# EAGLE board sketchv21111.0 (EAGLE 7.6.0)
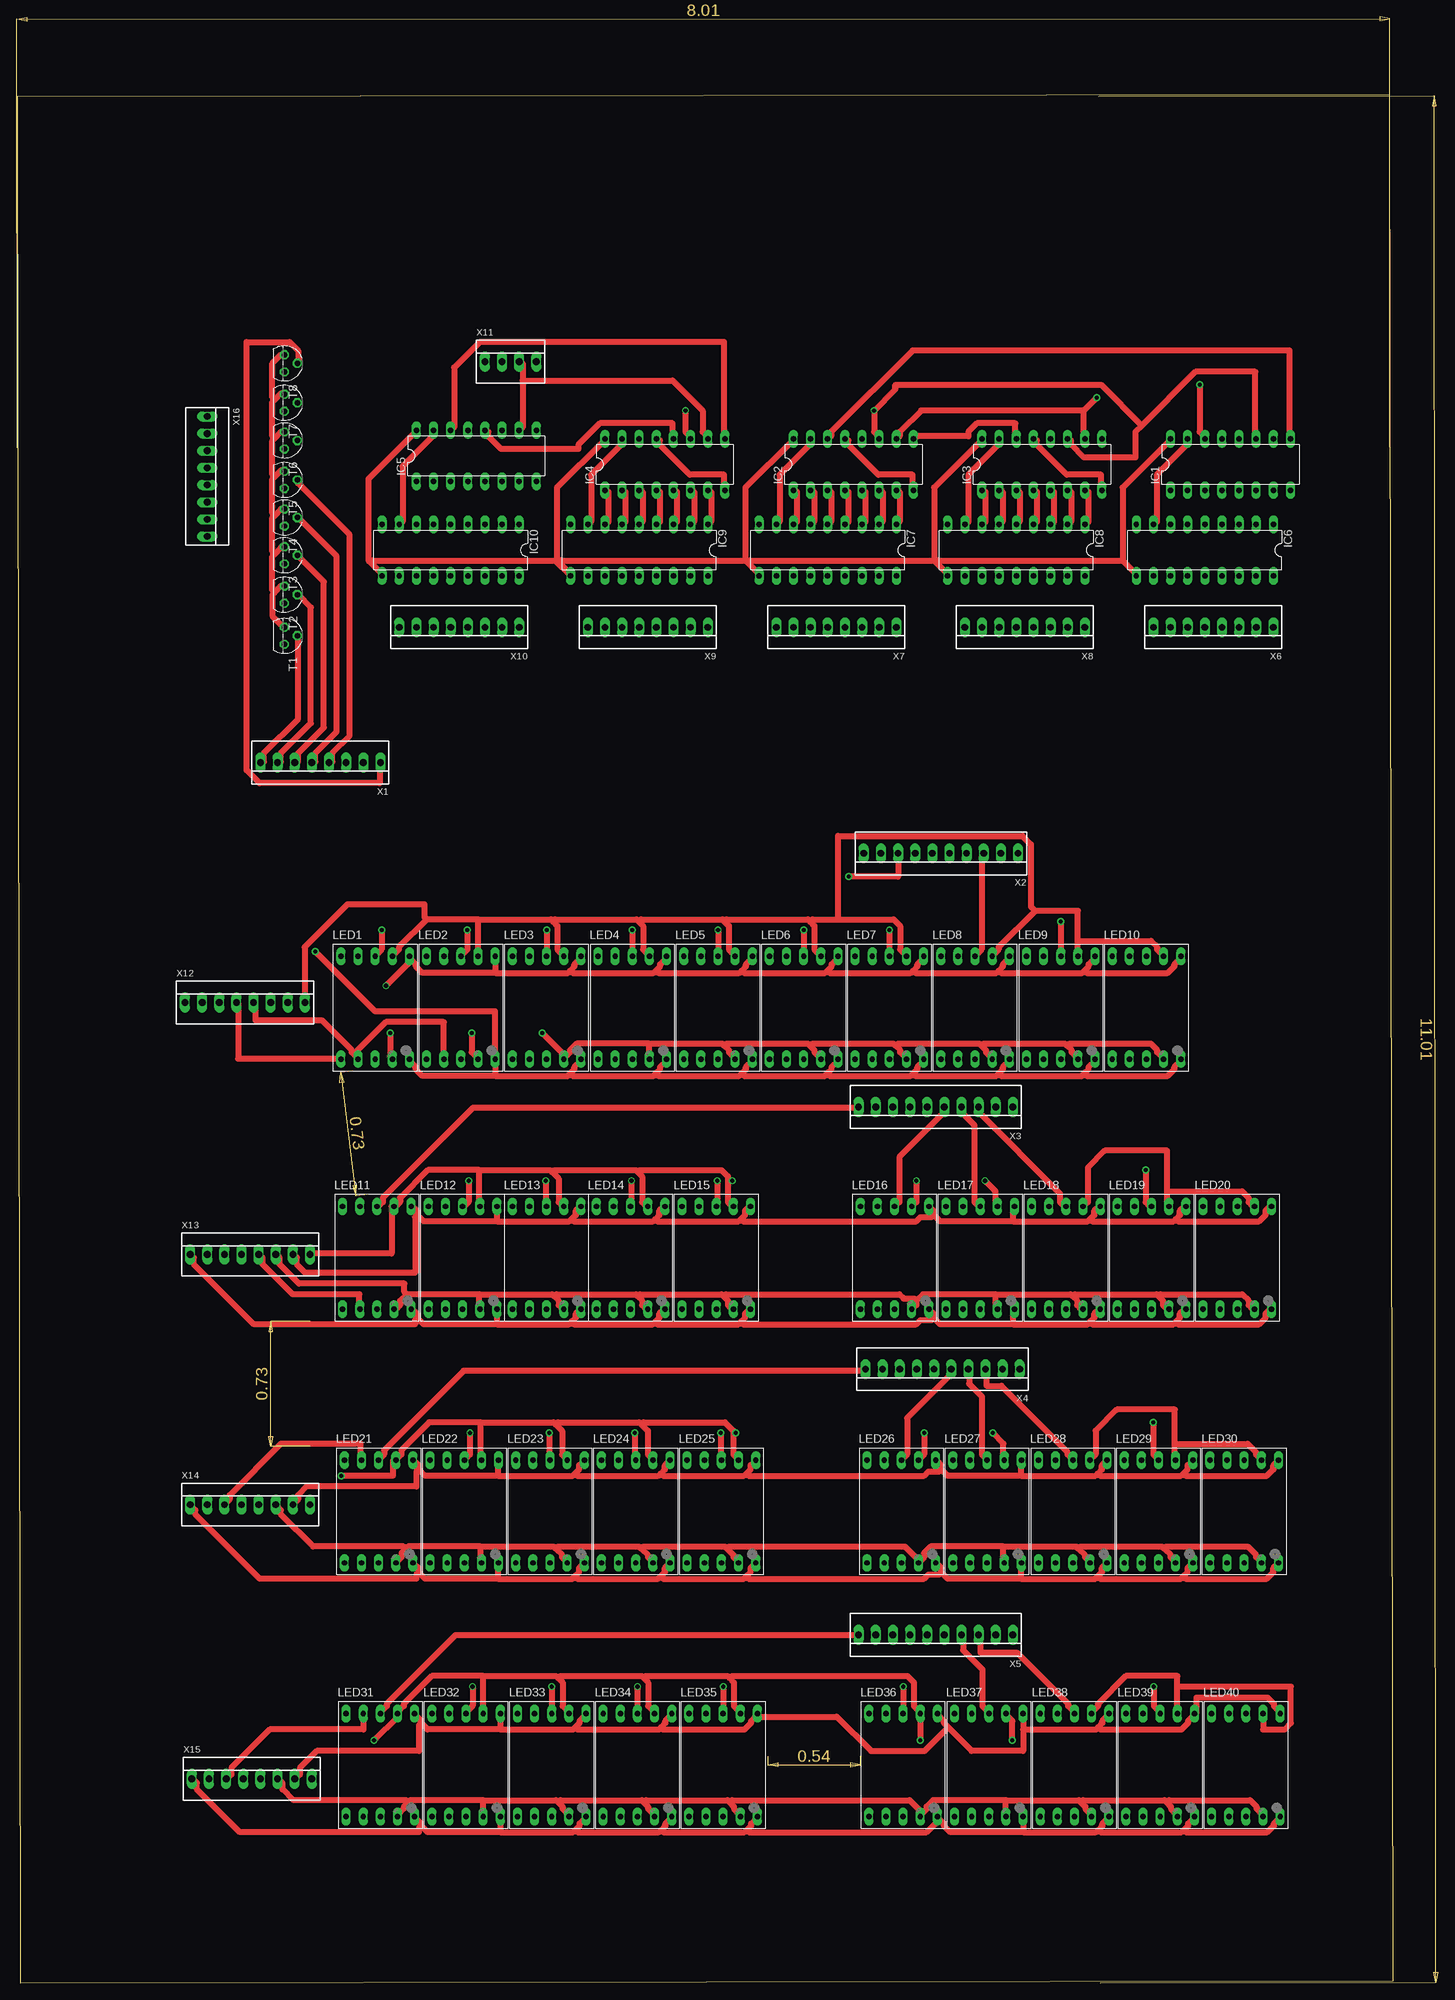
[diagram p1: board, top side]
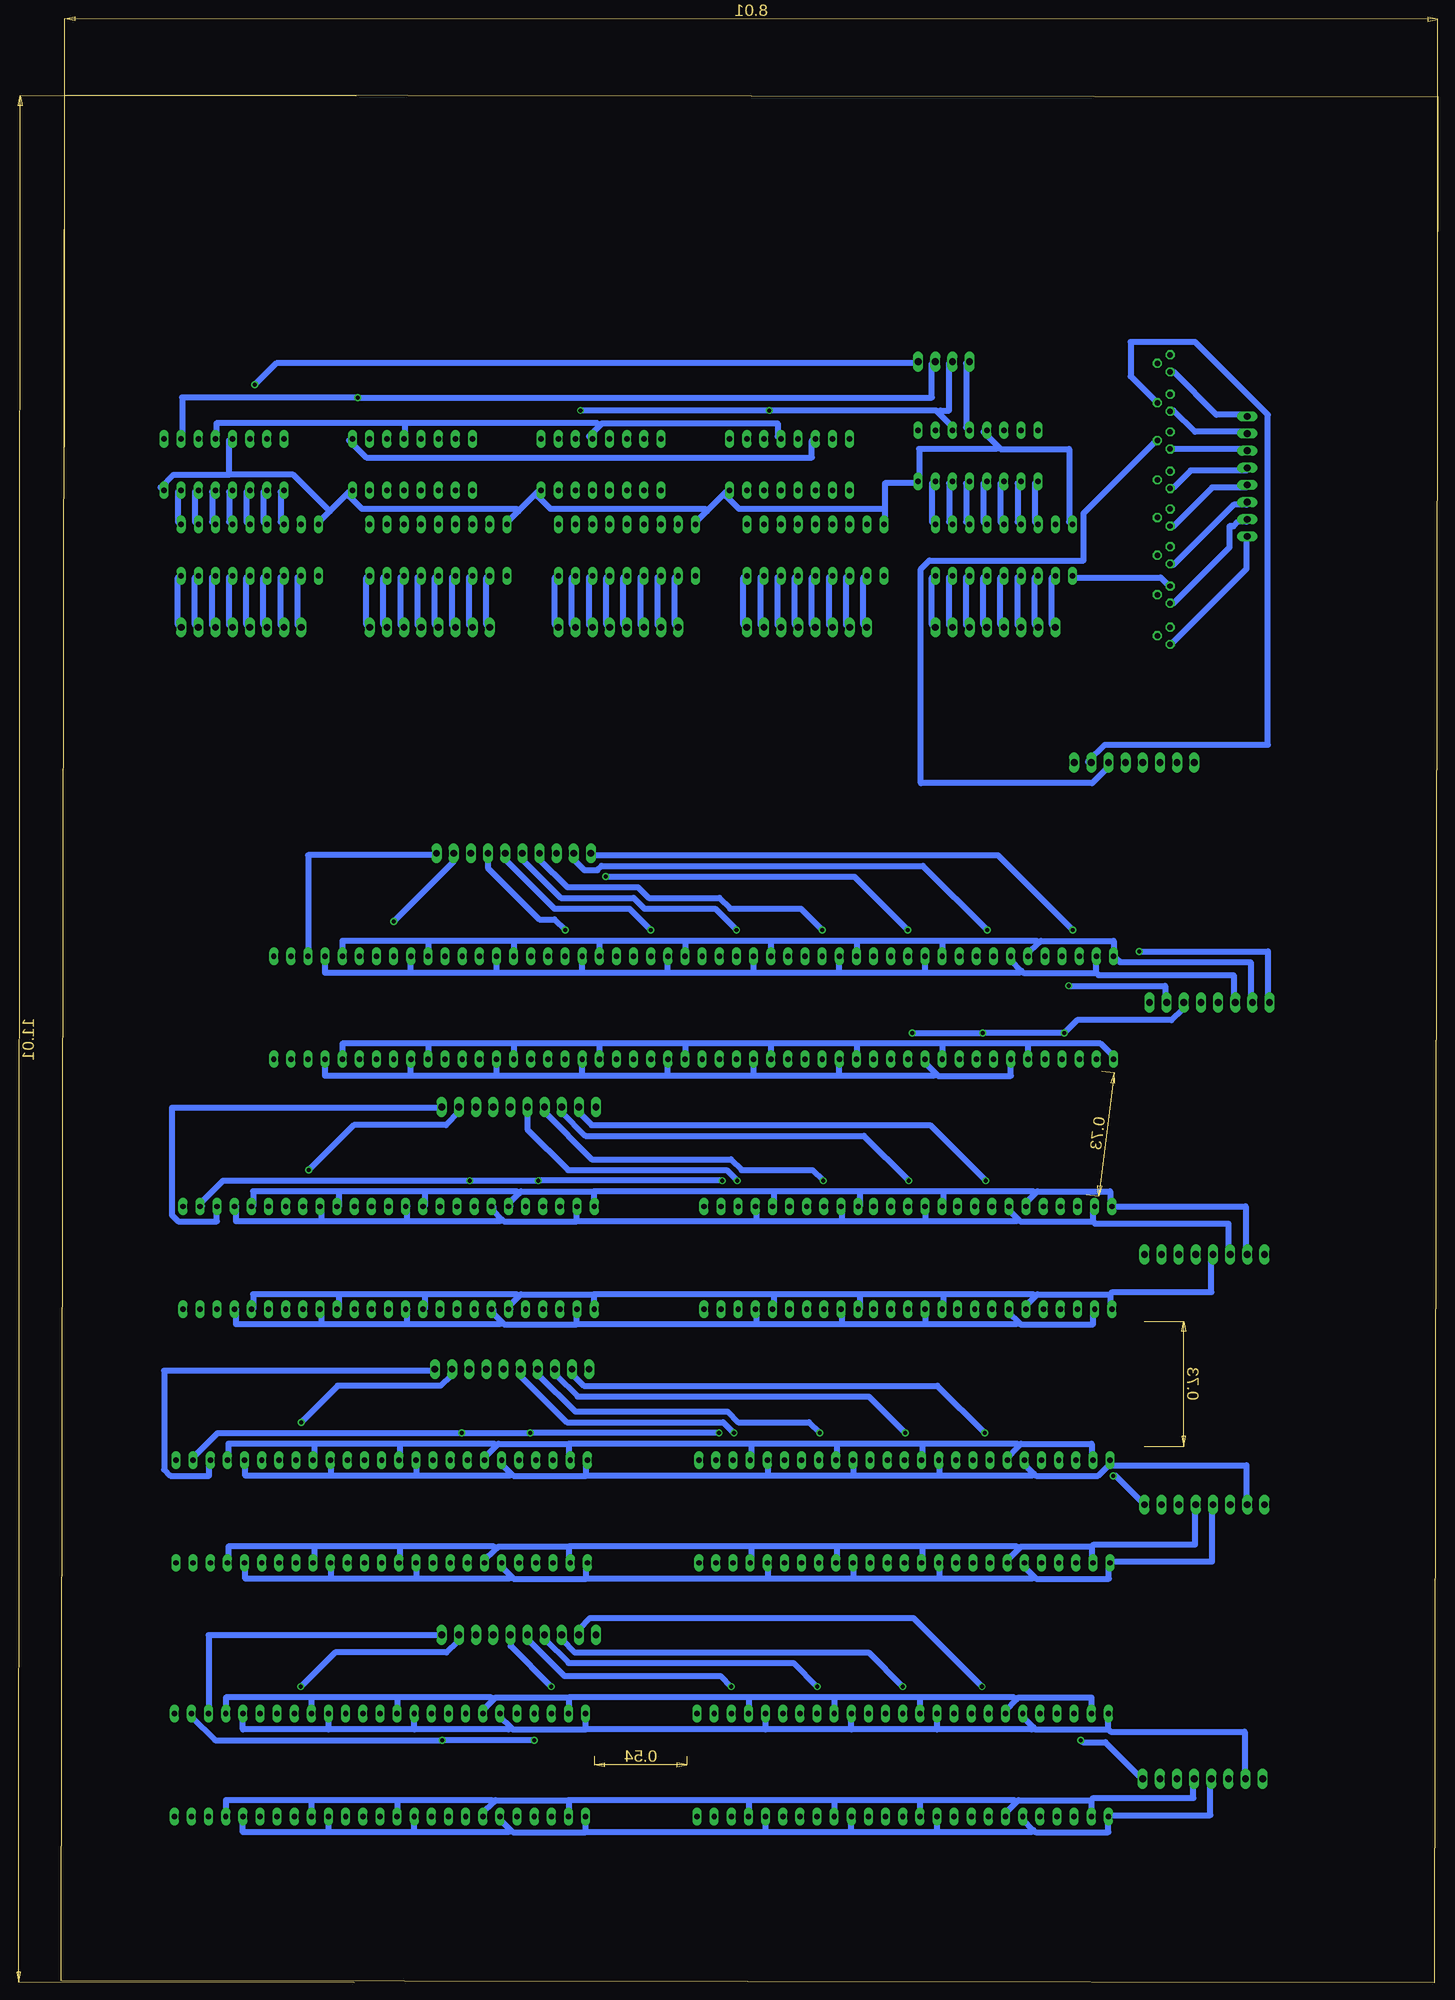
[diagram p2: board, bottom side, seen from below]

Size 203.94 x 279.83 mm. Coordinates in mm from the lower left corner, seen from the top.
Outline: 0.51,0 203.94,0.25 203.43,279.83 0,279.58 0.51,0
Copper layers (1*16): Top 0.035mm / dielectric 1.5mm / Bottom 0.035mm
Design rules "default": minimum track width 10mil, minimum drill 24mil, track to track 8mil, track to pad 8mil, pad to pad 8mil, via to via 8mil, smd to smd 8mil, copper to edge 40mil, drill to drill 8mil, minimum pad ring 10mil, minimum via ring 8mil, stop-mask expansion 4mil, vias tented up to drill 0mil, thermal gap 10mil
Net classes: 0 default: width 0.914 mm, clearance 0.457 mm

## Footprints (pad centres in the part's own frame; a part is rotated, then mirrored left to right if it is on the bottom)
DIL16 = drill 0.813 long: 1 -8.89,-3.81; 2 -6.35,-3.81; 3 -3.81,-3.81; 4 -1.27,-3.81; 5 1.27,-3.81; 6 3.81,-3.81; 7 6.35,-3.81; 8 8.89,-3.81; 9 8.89,3.81; 10 6.35,3.81; 11 3.81,3.81; 12 1.27,3.81; 13 -1.27,3.81; 14 -3.81,3.81; 15 -6.35,3.81; 16 -8.89,3.81
DIL18 = drill 0.813 long: 1 -10.16,-3.81; 2 -7.62,-3.81; 3 -5.08,-3.81; 4 -2.54,-3.81; 5 0,-3.81; 6 2.54,-3.81; 7 5.08,-3.81; 8 7.62,-3.81; 9 10.16,-3.81; 10 10.16,3.81; 11 7.62,3.81; 12 5.08,3.81; 13 2.54,3.81; 14 0,3.81; 15 -2.54,3.81; 16 -5.08,3.81; 17 -7.62,3.81; 18 -10.16,3.81
SA56-11 = drill 0.8 long: 1 -5.08,-7.62; 2 -2.54,-7.62; 3 0,-7.62; 4 2.54,-7.62; 5 5.08,-7.62; 6 5.08,7.62; 7 2.54,7.62; 8 0,7.62; 9 -2.54,7.62; 10 -5.08,7.62
TO92 = drill 0.813 octagon: 1 1.27,0; 2 0,1.905; 3 -1.27,0
22-23-2081 = drill 1 long: 1 -8.89,0; 2 -6.35,0; 3 -3.81,0; 4 -1.27,0; 5 1.27,0; 6 3.81,0; 7 6.35,0; 8 8.89,0
22-23-2101 = drill 1 long: 1 -11.43,0; 2 -8.89,0; 3 -6.35,0; 4 -3.81,0; 5 -1.27,0; 6 1.27,0; 7 3.81,0; 8 6.35,0; 9 8.89,0; 10 11.43,0
22-23-2041 = drill 1 long: 1 -3.81,0; 2 -1.27,0; 3 1.27,0; 4 3.81,0

## Placement (x,y rotation side)
IC1  74HC595N  [DIL16]  179.83,225.04 0 top
IC2  74HC595N  [DIL16]  123.95,225.04 0 top
IC3  74HC595N  [DIL16]  151.89,225.04 0 top
IC4  74HC595N  [DIL16]  96.01,225.04 0 top
IC5  74HC595N  [DIL16]  68.07,226.31 0 top
IC6  [DIL18]  176.02,212.34 180 top
IC7  [DIL18]  120.14,212.34 180 top
IC8  [DIL18]  148.08,212.34 180 top
IC9  [DIL18]  92.2,212.34 180 top
IC10  [DIL18]  64.26,212.34 180 top
LED1  7-SEG_SA56-11  [SA56-11]  53.09,144.53 0 top
LED2  7-SEG_SA56-11  [SA56-11]  65.79,144.53 0 top
LED3  7-SEG_SA56-11  [SA56-11]  78.49,144.53 0 top
LED4  7-SEG_SA56-11  [SA56-11]  91.19,144.53 0 top
LED5  7-SEG_SA56-11  [SA56-11]  103.89,144.53 0 top
LED6  7-SEG_SA56-11  [SA56-11]  116.59,144.53 0 top
LED7  7-SEG_SA56-11  [SA56-11]  129.29,144.53 0 top
LED8  7-SEG_SA56-11  [SA56-11]  141.99,144.53 0 top
LED9  7-SEG_SA56-11  [SA56-11]  154.69,144.53 0 top
LED10  7-SEG_SA56-11  [SA56-11]  167.39,144.53 0 top
LED11  7-SEG_SA56-11  [SA56-11]  53.34,107.44 0 top
LED12  7-SEG_SA56-11  [SA56-11]  66.04,107.44 0 top
LED13  7-SEG_SA56-11  [SA56-11]  78.49,107.44 0 top
LED14  7-SEG_SA56-11  [SA56-11]  90.93,107.44 0 top
LED15  7-SEG_SA56-11  [SA56-11]  103.63,107.44 0 top
LED16  7-SEG_SA56-11  [SA56-11]  130.05,107.44 0 top
LED17  7-SEG_SA56-11  [SA56-11]  142.75,107.44 0 top
LED18  7-SEG_SA56-11  [SA56-11]  155.45,107.44 0 top
LED19  7-SEG_SA56-11  [SA56-11]  168.15,107.44 0 top
LED20  7-SEG_SA56-11  [SA56-11]  180.85,107.44 0 top
LED21  7-SEG_SA56-11  [SA56-11]  53.59,69.85 0 top
LED22  7-SEG_SA56-11  [SA56-11]  66.29,69.85 0 top
LED23  7-SEG_SA56-11  [SA56-11]  78.99,69.85 0 top
LED24  7-SEG_SA56-11  [SA56-11]  91.69,69.85 0 top
LED25  7-SEG_SA56-11  [SA56-11]  104.39,69.85 0 top
LED26  7-SEG_SA56-11  [SA56-11]  131.06,69.85 0 top
LED27  7-SEG_SA56-11  [SA56-11]  143.76,69.85 0 top
LED28  7-SEG_SA56-11  [SA56-11]  156.46,69.85 0 top
LED29  7-SEG_SA56-11  [SA56-11]  169.16,69.85 0 top
LED30  7-SEG_SA56-11  [SA56-11]  181.86,69.85 0 top
LED31  7-SEG_SA56-11  [SA56-11]  53.85,32.26 0 top
LED32  7-SEG_SA56-11  [SA56-11]  66.55,32.26 0 top
LED33  7-SEG_SA56-11  [SA56-11]  79.25,32.26 0 top
LED34  7-SEG_SA56-11  [SA56-11]  91.95,32.26 0 top
LED35  7-SEG_SA56-11  [SA56-11]  104.65,32.26 0 top
LED36  7-SEG_SA56-11  [SA56-11]  131.32,32.26 0 top
LED37  7-SEG_SA56-11  [SA56-11]  144.02,32.26 0 top
LED38  7-SEG_SA56-11  [SA56-11]  156.72,32.26 0 top
LED39  7-SEG_SA56-11  [SA56-11]  169.42,32.26 0 top
LED40  7-SEG_SA56-11  [SA56-11]  182.12,32.26 0 top
T1  [TO92]  39.62,199.64 270 top
T2  [TO92]  39.62,205.74 270 top
T3  [TO92]  39.62,211.58 270 top
T4  [TO92]  39.62,217.17 270 top
T5  [TO92]  39.62,222.76 270 top
T6  [TO92]  39.62,228.6 270 top
T7  [TO92]  39.62,234.19 270 top
T8  [TO92]  39.62,240.03 270 top
X1  22-23-2081  [22-23-2081]  44.96,180.85 180 top
X2  22-23-2101  [22-23-2101]  136.91,167.39 180 top
X3  22-23-2101  [22-23-2101]  136.14,129.79 180 top
X4  22-23-2101  [22-23-2101]  137.16,90.93 180 top
X5  22-23-2101  [22-23-2101]  136.14,51.56 180 top
X6  22-23-2081  [22-23-2081]  177.29,200.91 180 top
X7  22-23-2081  [22-23-2081]  121.41,200.91 180 top
X8  22-23-2081  [22-23-2081]  149.35,200.91 180 top
X9  22-23-2081  [22-23-2081]  93.47,200.91 180 top
X10  22-23-2081  [22-23-2081]  65.53,200.91 180 top
X11  22-23-2041  [22-23-2041]  73.15,240.28 0 top
X12  22-23-2081  [22-23-2081]  33.78,145.29 0 top
X13  22-23-2081  [22-23-2081]  34.54,107.95 0 top
X14  22-23-2081  [22-23-2081]  34.54,70.87 0 top
X15  22-23-2081  [22-23-2081]  34.8,30.23 0 top
X16  22-23-2081  [22-23-2081]  28.19,223.27 270 top

## Tracks (layer width: path | path; a pad name or v marks a point on that pad's centre or on a via)
A
  Bottom 0.914: T1.1 39.12,198.75 28.32,209.55 28.32,214 X16.8
B
  Bottom 0.914: T2.1 39.12,204.47 30.86,212.72 30.86,215.9 30.23,215.9 29.59,216.53 28.32,216.53 X16.7
B1
  Top 0.914: T1.2 41.66,199.39 41.66,187.32 36.58,182.25 36.58,180.97 X1.8
B2
  Top 0.914: T2.2 41.66,205.74 43.56,203.84 43.56,186.69 39.12,182.25 39.12,180.97 X1.7
B3
  Top 0.914: T3.2 45.47,207.65 45.47,186.06 41.66,182.25 41.66,180.97 X1.6
B4
  Top 0.914: T4.2 41.66,217.17 47.37,211.46 47.37,185.42 44.2,182.25 44.2,180.97 X1.5
B5
  Top 0.914: T5.2 41.66,222.25 49.28,214.63 49.28,184.78 46.74,182.25 46.74,180.97 X1.4
B6
  Bottom 0.914: T6.2 41.66,228.6 52.45,217.81 52.45,210.82 75.31,210.82 76.58,209.55 76.58,177.8 51.18,177.8 48.64,180.34 X1.3
B7
  Bottom 0.914: T7.2 45.47,238.12 45.47,243.21 35.94,243.21 25.15,232.41 25.15,183.51 49.28,183.51 51.82,180.97 X1.2
B8
  Top 0.914: T8.2 41.66,240.03 41.66,241.94 40.39,243.21 34.04,243.21 34.04,179.71 35.94,177.8 53.72,177.8 53.72,180.34 X1.1
C
  Bottom 0.914: T3.1 39.12,210.19 30.23,219.07 28.32,219.07 X16.6
D
  Bottom 0.914: T4.1 39.12,215.9 33.4,221.62 28.32,221.62 X16.5
DS  (via drill 0.61)
  Top 0.914: v175.26,236.85 175.26,229.87 175.9,229.24 IC1.14
  Bottom 0.914: v175.26,236.85 172.09,240.03 77.47,240.03 X11.4
E
  Bottom 0.914: T5.1 39.12,221.62 36.58,224.16 28.32,224.16 X16.4
F
  Bottom 0.914: T6.1 28.32,227.33 X16.3
G
  Bottom 0.914: T7.1 39.12,233.04 35.94,229.87 28.32,229.87 X16.2
GND
  Top 0.914: IC3.13 151.13,228.6 151.13,227.97 155.58,223.52 160.66,223.52 160.66,221.62 IC3.8 | IC2.13 123.19,228.6 123.19,227.97 127.63,223.52 132.72,223.52 132.72,221.62 IC2.8 | IC4.13 95.25,228.6 95.25,227.97 99.69,223.52 104.77,223.52 104.77,221.62 IC4.8
  Bottom 0.914: 179.07,223.52 179.07,228.6 IC1.13 | 179.07,223.52 187.33,223.52 189.23,221.62 IC1.8 | 164.15,218.12 165.74,216.53 IC6.9 | 164.15,218.12 161.29,220.98 IC3.8 161.29,220.34 159.39,218.44 136.53,218.44 136.21,218.12 | 179.07,223.52 169.55,223.52 164.15,218.12 | 136.21,218.12 137.8,216.53 IC8.9 | 136.21,218.12 133.35,220.98 IC2.8 133.35,220.34 131.45,218.44 108.58,218.44 108.27,218.12 | 108.27,218.12 109.85,216.53 IC7.9 | 108.27,218.12 105.41,220.98 IC4.8 105.41,220.34 103.5,218.44 81.91,218.44 | 81.91,218.44 81.91,222.25 77.47,222.25 IC5.8 76.83,222.88 76.83,227.33 65.41,227.33 65.09,227.65 | 81.91,218.44 81.91,216.53 IC9.9 | 65.09,227.65 67.31,229.87 IC5.13 | 65.09,227.65 64.77,227.33 54.61,227.33 54.61,216.53 IC10.9
H
  Bottom 0.914: T8.1 39.12,238.76 32.77,232.41 28.32,232.41 X16.1
MR  (via drill 0.61)
  Top 0.914: 74.93,237.49 97.16,237.49 101.6,233.04 101.6,229.87 102.23,229.24 IC4.10 | 74.93,237.49 74.93,240.03 X11.3 | 74.93,237.49 74.93,230.5 IC5.10 | 158.12,233.04 133.99,233.04 130.81,229.87 130.81,229.24 IC2.10 | 158.12,233.04 158.12,229.24 IC3.10 | 158.12,233.04 v160.02,234.95
  Bottom 0.914: IC1.10 186.06,229.24 186.06,234.95 v160.02,234.95 74.93,234.95 74.93,240.03 X11.3
N$1
  Top 0.914: IC6.8 168.91,216.53 168.91,223.52 173.36,227.97 173.36,228.6 IC1.15
N$2
  Bottom 0.914: IC6.7 171.45,216.53 171.45,220.98 IC1.1
N$3
  Bottom 0.914: IC6.6 173.99,216.53 173.99,220.98 IC1.2
N$4
  Bottom 0.914: IC6.5 176.53,216.53 176.53,220.98 IC1.3
N$5
  Bottom 0.914: IC6.4 179.07,216.53 179.07,220.98 IC1.4
N$6
  Bottom 0.914: IC6.3 181.61,216.53 181.61,220.98 IC1.5
N$7
  Bottom 0.914: IC6.2 184.15,216.53 184.15,220.98 IC1.6
N$8
  Bottom 0.914: IC6.1 186.69,216.53 186.69,220.98 IC1.7
N$9
  Top 0.914: IC7.8 113.03,216.53 113.03,223.52 117.47,227.97 117.47,228.6 IC2.15
N$10
  Top 0.914: IC7.7 115.57,216.53 115.57,220.98 IC2.1
N$11
  Top 0.914: IC7.6 118.11,216.53 118.11,220.98 IC2.2
N$12
  Top 0.914: IC7.5 120.65,216.53 120.65,220.98 IC2.3
N$13
  Top 0.914: IC7.4 123.19,216.53 123.19,220.98 IC2.4
N$14
  Top 0.914: IC7.3 125.73,216.53 125.73,220.98 IC2.5
N$15
  Top 0.914: IC7.2 128.27,216.53 128.27,220.98 IC2.6
N$16
  Top 0.914: IC7.1 130.81,216.53 130.81,220.98 IC2.7
N$17
  Top 0.914: IC8.8 140.97,216.53 140.97,223.52 145.42,227.97 145.42,228.6 IC3.15
N$18
  Top 0.914: IC8.7 143.51,216.53 143.51,220.98 IC3.1
N$19
  Top 0.914: IC8.6 146.05,216.53 146.05,220.98 IC3.2
N$20
  Top 0.914: IC8.5 148.59,216.53 148.59,220.98 IC3.3
N$21
  Top 0.914: IC8.4 151.13,216.53 151.13,220.98 IC3.4
N$22
  Top 0.914: IC8.3 153.67,216.53 153.67,220.98 IC3.5
N$23
  Top 0.914: IC8.2 156.21,216.53 156.21,220.98 IC3.6
N$24
  Top 0.914: IC8.1 158.75,216.53 158.75,220.98 IC3.7
N$25
  Top 0.914: IC9.8 85.09,216.53 85.09,223.52 89.53,227.97 89.53,228.6 IC4.15
N$26
  Top 0.914: IC9.7 87.63,216.53 87.63,220.98 IC4.1
N$27
  Top 0.914: IC9.6 90.17,216.53 90.17,220.98 IC4.2
N$28
  Top 0.914: IC9.5 92.71,216.53 92.71,220.98 IC4.3
N$29
  Top 0.914: IC9.4 95.25,216.53 95.25,220.98 IC4.4
N$30
  Top 0.914: IC9.3 97.79,216.53 97.79,220.98 IC4.5
N$31
  Top 0.914: IC9.2 100.33,216.53 100.33,220.98 IC4.6
N$32
  Top 0.914: IC9.1 102.87,216.53 102.87,220.98 IC4.7
N$33
  Top 0.914: IC10.8 57.15,216.53 57.15,224.79 61.6,229.24 61.6,229.87 IC5.15
N$34
  Bottom 0.914: IC10.7 59.69,216.53 59.69,222.25 IC5.1
N$35
  Bottom 0.914: IC10.6 62.23,216.53 62.23,222.25 IC5.2
N$36
  Bottom 0.914: IC10.5 64.77,216.53 64.77,222.25 IC5.3
N$37
  Bottom 0.914: IC10.4 67.31,216.53 67.31,222.25 IC5.4
N$38
  Bottom 0.914: IC10.3 69.85,216.53 69.85,222.25 IC5.5
N$39
  Bottom 0.914: IC10.2 72.39,216.53 72.39,222.25 IC5.6
N$40
  Bottom 0.914: IC10.1 74.93,216.53 74.93,222.25 IC5.7
N$41
  Top 0.914: IC2.14 120.65,229.24 120.65,229.87 132.72,241.94 188.59,241.94 188.59,229.24 IC1.9
N$42
  Bottom 0.914: IC6.11 168.91,208.28 168.91,201.29 X6.8
N$43
  Bottom 0.914: IC6.12 171.45,208.28 171.45,201.29 X6.7
N$44
  Bottom 0.914: IC6.13 173.99,208.28 173.99,201.29 X6.6
N$45
  Bottom 0.914: IC6.14 176.53,208.28 176.53,201.29 X6.5
N$46
  Bottom 0.914: IC6.15 179.07,208.28 179.07,201.29 X6.4
N$47
  Bottom 0.914: IC6.16 181.61,208.28 181.61,201.29 X6.3
N$48
  Bottom 0.914: IC6.17 184.15,208.28 184.15,201.29 X6.2
N$49
  Bottom 0.914: IC6.18 186.69,208.28 186.69,201.29 X6.1
N$50
  Bottom 0.914: IC7.11 113.03,208.28 113.03,201.29 X7.8
N$51
  Bottom 0.914: IC7.12 115.57,208.28 115.57,201.29 X7.7
N$52
  Bottom 0.914: IC7.13 118.11,208.28 118.11,201.29 X7.6
N$53
  Bottom 0.914: IC7.14 120.65,208.28 120.65,201.29 X7.5
N$54
  Bottom 0.914: IC7.15 123.19,208.28 123.19,201.29 X7.4
N$55
  Bottom 0.914: IC7.16 125.73,208.28 125.73,201.29 X7.3
N$56
  Bottom 0.914: IC7.17 128.27,208.28 128.27,201.29 X7.2
N$57
  Bottom 0.914: IC7.18 130.81,208.28 130.81,201.29 X7.1
N$58
  Bottom 0.914: IC8.11 140.97,208.28 140.97,201.29 X8.8
N$59
  Bottom 0.914: IC8.12 143.51,208.28 143.51,201.29 X8.7
N$60
  Bottom 0.914: IC8.13 146.05,208.28 146.05,201.29 X8.6
N$61
  Bottom 0.914: IC8.14 148.59,208.28 148.59,201.29 X8.5
N$62
  Bottom 0.914: IC8.15 151.13,208.28 151.13,201.29 X8.4
N$63
  Bottom 0.914: IC8.16 153.67,208.28 153.67,201.29 X8.3
N$64
  Bottom 0.914: IC8.17 156.21,208.28 156.21,201.29 X8.2
N$65
  Bottom 0.914: IC8.18 158.75,208.28 158.75,201.29 X8.1
N$66
  Bottom 0.914: IC9.11 85.09,208.28 85.09,201.29 X9.8
N$67
  Bottom 0.914: IC9.12 87.63,208.28 87.63,201.29 X9.7
N$68
  Bottom 0.914: IC9.13 90.17,208.28 90.17,201.29 X9.6
N$69
  Bottom 0.914: IC9.14 92.71,208.28 92.71,201.29 X9.5
N$70
  Bottom 0.914: IC9.15 95.25,208.28 95.25,201.29 X9.4
N$71
  Bottom 0.914: IC9.16 97.79,208.28 97.79,201.29 X9.3
N$72
  Bottom 0.914: IC9.17 100.33,208.28 100.33,201.29 X9.2
N$73
  Bottom 0.914: IC9.18 102.87,208.28 102.87,201.29 X9.1
N$74
  Bottom 0.914: IC10.11 57.15,208.28 57.15,201.29 X10.8
N$75
  Bottom 0.914: IC10.12 59.69,208.28 59.69,201.29 X10.7
N$76
  Bottom 0.914: IC10.13 62.23,208.28 62.23,201.29 X10.6
N$77
  Bottom 0.914: IC10.14 64.77,208.28 64.77,201.29 X10.5
N$78
  Bottom 0.914: IC10.15 67.31,208.28 67.31,201.29 X10.4
N$79
  Bottom 0.914: IC10.16 69.85,208.28 69.85,201.29 X10.3
N$80
  Bottom 0.914: IC10.17 72.39,208.28 72.39,201.29 X10.2
N$81
  Bottom 0.914: IC10.18 74.93,208.28 74.93,201.29 X10.1
N$103
  Top 0.914: IC2.9 133.35,229.24 140.97,229.24 140.97,229.87 142.24,231.14 147.96,231.14 147.96,229.24 IC3.14
N$112
  Bottom 0.914: IC4.14 92.71,228.6 92.71,226.06 158.75,226.06 161.29,228.6 IC3.9
N$121
  Top 0.914: IC5.14 64.77,230.5 64.77,239.4 68.58,243.21 104.77,243.21 104.77,229.24 IC4.9
R1A
  Top 0.914: 150.88,158.88 145.48,153.48 145.48,153.16 144.53,152.21 LED8.7 | 150.88,158.88 157.23,158.88 157.23,154.43 | LED9.7 157.23,154.43 | 157.23,154.43 168.02,154.43 168.97,153.48 168.97,153.16 169.93,152.21 LED10.7 | 60.71,157.61 56.58,153.48 56.58,153.16 55.63,152.21 LED1.7 | 68.33,157.61 60.71,157.61 | LED2.7 68.33,157.61 | 79.44,157.29 79.12,157.61 68.33,157.61 | 79.44,157.29 80.07,156.66 80.07,153.16 81.03,152.21 LED3.7 | 92.14,157.29 91.82,157.61 79.76,157.61 79.44,157.29 | 92.14,157.29 92.77,156.66 92.77,153.16 93.73,152.21 LED4.7 | 104.84,157.29 104.52,157.61 92.46,157.61 92.14,157.29 | 104.84,157.29 105.47,156.66 105.47,153.16 106.43,152.21 LED5.7 | 117.54,157.29 117.22,157.61 105.16,157.61 104.84,157.29 | 117.54,157.29 118.17,156.66 118.17,153.16 119.13,152.21 LED6.7 | 121.67,157.61 117.86,157.61 117.54,157.29 | 121.67,157.61 129.92,157.61 130.87,156.66 130.87,153.16 131.83,152.21 LED7.7 | X12.8 42.61,145.54 42.61,153.48 48.96,159.83 60.39,159.83 60.39,157.92 60.71,157.61 | 121.67,157.61 121.67,169.99 148.97,169.99 150.24,168.72 150.24,159.51 150.88,158.88
R1B  (via drill 0.61)
  Top 0.914: 70.87,149.67 60.07,149.67 59.12,150.62 59.12,150.94 58.17,151.89 LED1.6 58.17,151.26 v54.67,147.76 | LED2.6 70.87,149.67 | 81.98,149.99 81.66,149.67 70.87,149.67 | 81.98,149.99 82.61,150.62 82.61,150.94 83.57,151.89 LED3.6 | 94.68,149.99 94.36,149.67 82.3,149.67 81.98,149.99 | 94.68,149.99 95.31,150.62 95.31,150.94 96.27,151.89 LED4.6 | 107.38,149.99 107.06,149.67 95,149.67 94.68,149.99 | 107.38,149.99 108.01,150.62 108.01,150.94 108.97,151.89 LED5.6 | 120.08,149.99 119.76,149.67 107.7,149.67 107.38,149.99 | 120.08,149.99 120.71,150.62 120.71,150.94 121.67,151.89 LED6.6 | 132.78,149.99 132.46,149.67 120.4,149.67 120.08,149.99 | 132.78,149.99 133.41,150.62 133.41,150.94 134.37,151.89 LED7.6 | 145.48,149.99 145.16,149.67 133.1,149.67 132.78,149.99 | 145.48,149.99 146.11,150.62 146.11,150.94 147.07,151.89 LED8.6 | 158.18,149.99 157.86,149.67 145.8,149.67 145.48,149.99 | 158.18,149.99 158.81,150.62 158.81,150.94 159.77,151.89 LED9.6 | LED10.6 172.47,151.89 171.51,150.94 171.51,150.62 170.56,149.67 158.5,149.67 158.18,149.99
  Bottom 0.914: v54.67,147.76 40.39,147.76 40.39,145.54 X12.7
R1C  (via drill 0.61)
  Top 0.914: v55.31,140.78 55.31,137.29 55.63,136.97 LED1.4 | v67.37,140.78 67.37,137.92 68.33,136.97 LED2.4 | 93.73,139.19 82.93,139.19 81.98,138.24 81.98,137.92 81.03,136.97 LED3.4 81.03,137.6 v77.85,140.78 | LED4.4 93.73,139.19 | 104.84,138.88 104.52,139.19 93.73,139.19 | 104.84,138.88 105.47,138.24 105.47,137.92 106.43,136.97 LED5.4 | 117.54,138.88 117.22,139.19 105.16,139.19 104.84,138.88 | 117.54,138.88 118.17,138.24 118.17,137.92 119.13,136.97 LED6.4 | 130.24,138.88 129.92,139.19 117.86,139.19 117.54,138.88 | 130.24,138.88 130.87,138.24 130.87,137.92 131.83,136.97 LED7.4 | 142.94,138.88 142.62,139.19 130.56,139.19 130.24,138.88 | 142.94,138.88 143.57,138.24 143.57,137.92 144.53,136.97 LED8.4 | 155.64,138.88 155.32,139.19 143.26,139.19 142.94,138.88 | 155.64,138.88 156.27,138.24 156.27,137.92 157.23,136.97 LED9.4 | LED10.4 169.93,136.97 168.97,137.92 168.97,138.24 168.02,139.19 155.96,139.19 155.64,138.88
  Bottom 0.914: X12.6 37.85,145.22 37.85,144.27 39.43,142.69 53.4,142.69 v55.31,140.78 v67.37,140.78 v77.85,140.78
R1D
  Top 0.914: X12.5 35.31,145.22 35.31,142.69 45.15,142.69 49.59,138.24 49.59,137.92 50.55,136.97 LED1.2 50.23,137.92 54.67,142.37 63.25,142.37 LED2.2
  Bottom 0.914: LED2.2 63.25,134.43 74.04,134.43 74.36,134.75 | 74.36,134.75 75.95,136.33 LED3.2 | 88.65,134.43 LED4.2 | 88.65,134.43 74.68,134.43 74.36,134.75 | 101.35,134.43 LED5.2 | 88.65,134.43 101.35,134.43 | 114.05,134.43 LED6.2 | 101.35,134.43 114.05,134.43 | 126.75,134.43 LED7.2 | 114.05,134.43 126.75,134.43 | 139.45,134.43 LED8.2 | 126.75,134.43 139.45,134.43 | 152.15,134.43 LED9.2 | 139.45,134.43 152.15,134.43 | LED10.2 164.85,134.43 152.15,134.43
R1E
  Top 0.914: LED1.1 48.01,136.97 32.77,136.97 32.77,145.22 X12.4
  Bottom 0.914: 60.71,139.19 LED2.1 | 60.71,139.19 49.91,139.19 48.01,137.29 LED1.1 | 73.41,139.19 LED3.1 | 60.71,139.19 73.41,139.19 | 86.11,139.19 LED4.1 | 73.41,139.19 86.11,139.19 | 98.81,139.19 LED5.1 | 86.11,139.19 98.81,139.19 | 111.51,139.19 LED6.1 | 98.81,139.19 111.51,139.19 | 124.21,139.19 LED7.1 | 111.51,139.19 124.21,139.19 | 136.91,139.19 LED8.1 | 124.21,139.19 136.91,139.19 | 149.61,139.19 LED9.1 | 136.91,139.19 149.61,139.19 | LED10.1 162.31,139.19 149.61,139.19
R1F
  Bottom 0.914: 50.55,149.67 LED1.9 | 50.55,149.67 61.34,149.67 61.66,149.99 | 61.66,149.99 63.25,151.57 LED2.9 | 75.95,149.67 LED3.9 | 75.95,149.67 61.98,149.67 61.66,149.99 | 88.65,149.67 LED4.9 | 75.95,149.67 88.65,149.67 | 101.35,149.67 LED5.9 | 88.65,149.67 101.35,149.67 | 114.05,149.67 LED6.9 | 101.35,149.67 114.05,149.67 | 126.75,149.67 LED7.9 | 114.05,149.67 126.75,149.67 | 139.45,149.67 LED8.9 | 126.75,149.67 139.45,149.67 | 152.15,149.67 LED9.9 | 139.45,149.67 152.15,149.67 | LED10.9 164.85,149.67 152.15,149.67 | X12.3 30.23,145.54 30.23,149.35 50.23,149.35 50.55,149.67
R1G
  Bottom 0.914: 59.12,154.11 60.71,152.53 LED2.10 | 59.12,154.11 58.8,154.43 48.01,154.43 LED1.10 47.69,151.89 47.05,151.26 27.69,151.26 27.69,145.54 X12.2 | 73.41,154.43 LED3.10 | 73.41,154.43 59.44,154.43 59.12,154.11 | 86.11,154.43 LED4.10 | 73.41,154.43 86.11,154.43 | 98.81,154.43 LED5.10 | 86.11,154.43 98.81,154.43 | 111.51,154.43 LED6.10 | 98.81,154.43 111.51,154.43 | 124.21,154.43 LED7.10 | 111.51,154.43 124.21,154.43 | 136.91,154.43 LED8.10 | 124.21,154.43 136.91,154.43 | 149.61,154.43 LED9.10 | 136.91,154.43 149.61,154.43 | LED10.10 162.31,154.43 149.61,154.43
R1H  (via drill 0.61)
  Top 0.914: 70.87,134.43 60.07,134.43 59.12,135.38 59.12,135.7 58.17,136.65 LED1.5 | 70.87,134.43 LED2.5 70.87,143.95 53.09,143.95 v44.2,152.84 | 81.98,134.75 81.66,134.43 70.87,134.43 | 81.98,134.75 82.61,135.38 82.61,135.7 83.57,136.65 LED3.5 | 94.68,134.75 94.36,134.43 82.3,134.43 81.98,134.75 | 94.68,134.75 95.31,135.38 95.31,135.7 96.27,136.65 LED4.5 | 107.38,134.75 107.06,134.43 95,134.43 94.68,134.75 | 107.38,134.75 108.01,135.38 108.01,135.7 108.97,136.65 LED5.5 | 120.08,134.75 119.76,134.43 107.7,134.43 107.38,134.75 | 120.08,134.75 120.71,135.38 120.71,135.7 121.67,136.65 LED6.5 | 132.78,134.75 132.46,134.43 120.4,134.43 120.08,134.75 | 132.78,134.75 133.41,135.38 133.41,135.7 134.37,136.65 LED7.5 | 145.48,134.75 145.16,134.43 133.1,134.43 132.78,134.75 | 145.48,134.75 146.11,135.38 146.11,135.7 147.07,136.65 LED8.5 | 158.18,134.75 157.86,134.43 145.8,134.43 145.48,134.75 | 158.18,134.75 158.81,135.38 158.81,135.7 159.77,136.65 LED9.5 | LED10.5 172.47,136.65 171.51,135.7 171.51,135.38 170.56,134.43 158.5,134.43 158.18,134.75
  Bottom 0.914: v44.2,152.84 25.15,152.84 25.15,145.54 X12.1
R2A  (via drill 0.61)
  Top 0.914: v133.29,118.87 133.29,115.7 132.65,115.06 LED16.7 | v143.45,118.87 145.03,117.28 145.03,115.06 LED17.7 | 170.43,117.28 170.43,115.06 LED19.7 | 170.43,117.28 170.43,123.32 161.23,123.32 158.69,120.78 158.69,115.7 158.05,115.06 LED18.7 | 170.43,117.28 181.55,117.28 182.5,116.33 182.5,115.7 183.13,115.06 LED20.7 | 68.52,120.46 60.9,120.46 56.77,116.33 56.77,115.7 56.13,115.06 LED11.7 55.5,115.06 55.5,108.08 43.69,108.08 X13.8 | 68.52,120.46 68.52,115.06 LED12.7 | 79.31,120.14 78.99,120.46 68.52,120.46 | 79.31,120.14 80.26,119.19 80.26,115.7 80.9,115.06 LED13.7 | 92.01,120.14 91.69,120.46 79.63,120.46 79.31,120.14 | 92.01,120.14 92.65,119.51 92.65,115.7 93.28,115.06 LED14.7 | 105.35,118.87 105.35,119.51 104.39,120.46 92.33,120.46 92.01,120.14 | 105.35,118.87 105.35,115.7 105.98,115.06 LED15.7 | v105.98,118.87 105.35,118.87
  Bottom 0.914: LED20.7 183.13,115.06 183.13,115.7 179.96,118.87 v143.45,118.87 v133.29,118.87 v105.98,118.87
R2B
  Top 0.914: 135.83,113.79 135.83,114.43 135.19,115.06 LED16.6 | 135.83,113.79 136.78,112.84 147.57,112.84 | 147.57,112.84 147.57,115.06 LED17.6 | 159,113.16 158.69,112.84 147.57,112.84 | 159,113.16 159.64,113.79 159.64,114.43 160.27,115.06 LED18.6 | 171.7,113.16 171.39,112.84 159.32,112.84 159,113.16 | 171.7,113.16 172.34,113.79 172.34,114.43 172.97,115.06 LED19.6 | LED20.6 185.67,115.06 185.04,114.43 185.04,113.79 184.09,112.84 172.02,112.84 171.7,113.16 | 59.31,113.79 59.31,114.43 58.67,115.06 LED11.6 | 59.31,113.79 60.26,112.84 71.06,112.84 | 71.06,112.84 71.06,115.06 LED12.6 | 82.17,113.16 81.85,112.84 71.06,112.84 | 82.17,113.16 82.8,113.79 82.8,114.43 83.44,115.06 LED13.6 | 94.55,113.16 94.23,112.84 82.49,112.84 82.17,113.16 | 94.55,113.16 95.19,113.79 95.19,114.43 95.82,115.06 LED14.6 | 107.25,113.16 106.93,112.84 94.87,112.84 94.55,113.16 | 107.25,113.16 107.89,113.79 107.89,114.43 108.52,115.06 LED15.6 | X13.7 41.15,107.76 41.47,107.44 41.47,106.49 42.73,105.22 58.99,105.22 58.99,113.47 59.31,113.79 | 135.83,113.79 135.51,113.47 133.92,113.47 133.29,112.84 107.57,112.84 107.25,113.16
R2C
  Top 0.914: 133.29,101.09 133.29,100.46 132.65,99.82 LED16.4 | 133.29,101.09 134.24,102.04 145.03,102.04 | 145.03,102.04 145.03,99.82 LED17.4 | 156.46,101.73 156.15,102.04 145.03,102.04 | 156.46,101.73 157.1,101.09 157.1,100.46 157.73,99.82 LED18.4 | 169.16,101.73 168.85,102.04 156.78,102.04 156.46,101.73 | 169.16,101.73 169.8,101.09 169.8,100.46 170.43,99.82 LED19.4 | LED20.4 183.13,99.82 182.5,100.46 182.5,101.09 181.55,102.04 169.48,102.04 169.16,101.73 | 57.72,102.04 56.77,101.09 56.77,100.46 56.13,99.82 LED11.4 | 68.52,102.04 57.72,102.04 | 68.52,102.04 68.52,99.82 LED12.4 | 79.63,101.73 79.31,102.04 68.52,102.04 | 79.63,101.73 80.26,101.09 80.26,100.46 80.9,99.82 LED13.4 | 92.01,101.73 91.69,102.04 79.95,102.04 79.63,101.73 | 92.01,101.73 92.65,101.09 92.65,100.46 93.28,99.82 LED14.4 | 104.71,101.73 104.39,102.04 92.33,102.04 92.01,101.73 | 104.71,101.73 105.35,101.09 105.35,100.46 105.98,99.82 LED15.4 | X13.6 38.61,107.76 38.93,107.44 38.93,106.49 41.78,103.63 57.4,103.63 57.4,102.36 57.72,102.04 | 133.29,101.09 132.97,101.41 131.38,101.41 130.75,102.04 105.03,102.04 104.71,101.73
R2D
  Top 0.914: X13.5 36.07,107.76 36.39,107.44 36.39,106.49 40.83,102.04 50.74,102.04 50.74,99.82 LED11.2
  Bottom 0.914: 127.57,97.6 127.57,99.82 LED16.2 | 127.57,97.6 138.37,97.6 138.68,97.92 | 138.68,97.92 139.95,99.19 139.95,99.82 LED17.2 | 152.65,97.6 152.65,99.82 LED18.2 | 152.65,97.6 139,97.6 138.68,97.92 | 165.35,97.6 165.35,99.82 LED19.2 | 152.65,97.6 165.35,97.6 | 165.35,97.6 178.05,97.6 178.05,99.82 LED20.2 | 62.17,97.92 63.44,99.19 63.44,99.82 LED12.2 | 62.17,97.92 61.85,97.6 51.05,97.6 51.05,99.82 LED11.2 | 75.82,97.6 75.82,99.82 LED13.2 | 75.82,97.6 62.48,97.6 62.17,97.92 | 88.2,97.6 88.2,99.82 LED14.2 | 75.82,97.6 88.2,97.6 | 100.9,97.6 100.9,99.82 LED15.2 | 88.2,97.6 100.9,97.6 | 100.9,97.6 127.57,97.6
R2E
  Bottom 0.914: 125.03,102.04 125.03,99.82 LED16.1 | 125.03,102.04 135.83,102.04 136.14,101.73 | 136.14,101.73 137.41,100.46 137.41,99.82 LED17.1 | 150.11,102.04 150.11,99.82 LED18.1 | 150.11,102.04 136.46,102.04 136.14,101.73 | 162.81,102.04 162.81,99.82 LED19.1 | 150.11,102.04 162.81,102.04 | 162.81,102.04 175.51,102.04 175.51,99.82 LED20.1 | 48.51,102.04 48.51,99.82 LED11.1 | 48.51,102.04 59.31,102.04 59.63,101.73 | 59.63,101.73 60.9,100.46 60.9,99.82 LED12.1 | 73.28,102.04 73.28,99.82 LED13.1 | 73.28,102.04 59.94,102.04 59.63,101.73 | 85.66,102.04 85.66,99.82 LED14.1 | 73.28,102.04 85.66,102.04 | 98.36,102.04 98.36,99.82 LED15.1 | 85.66,102.04 98.36,102.04 | X13.4 33.53,107.76 33.53,102.36 48.2,102.36 48.51,102.04 | 98.36,102.04 125.03,102.04
R2F
  Bottom 0.914: 127.57,112.84 127.57,115.06 LED16.9 | 127.57,112.84 138.37,112.84 138.68,113.16 | 138.68,113.16 139.95,114.43 139.95,115.06 LED17.9 | 152.65,112.84 152.65,115.06 LED18.9 | 152.65,112.84 139,112.84 138.68,113.16 | 165.35,112.84 165.35,115.06 LED19.9 | 152.65,112.84 165.35,112.84 | 165.35,112.84 178.05,112.84 178.05,115.06 LED20.9 | 51.05,112.84 51.05,115.06 LED11.9 | 51.05,112.84 61.85,112.84 62.17,113.16 | 62.17,113.16 63.44,114.43 63.44,115.06 LED12.9 | 75.82,112.84 75.82,115.06 LED13.9 | 75.82,112.84 62.48,112.84 62.17,113.16 | 88.2,112.84 88.2,115.06 LED14.9 | 75.82,112.84 88.2,112.84 | 100.9,112.84 100.9,115.06 LED15.9 | 88.2,112.84 100.9,112.84 | X13.3 30.99,108.08 30.99,112.52 50.74,112.52 51.05,112.84 | 100.9,112.84 127.57,112.84
R2G
  Bottom 0.914: 125.03,117.28 125.03,115.06 LED16.10 | 125.03,117.28 135.83,117.28 136.14,116.97 | 136.14,116.97 137.41,115.7 137.41,115.06 LED17.10 | 150.11,117.28 150.11,115.06 LED18.10 | 150.11,117.28 136.46,117.28 136.14,116.97 | 162.81,117.28 162.81,115.06 LED19.10 | 150.11,117.28 162.81,117.28 | 162.81,117.28 175.51,117.28 175.51,115.06 LED20.10 | 59.63,116.97 60.9,115.7 60.9,115.06 LED12.10 | 59.63,116.97 59.31,117.28 48.51,117.28 48.51,115.06 LED11.10 28.45,115.06 28.45,108.08 X13.2 | 73.28,117.28 73.28,115.06 LED13.10 | 73.28,117.28 59.94,117.28 59.63,116.97 | 85.66,117.28 85.66,115.06 LED14.10 | 73.28,117.28 85.66,117.28 | 98.36,117.28 98.36,115.06 LED15.10 | 85.66,117.28 98.36,117.28 | 98.36,117.28 125.03,117.28
R2H
  Top 0.914: 135.83,98.55 135.83,99.19 135.19,99.82 LED16.5 | 135.83,98.55 136.78,97.6 147.57,97.6 | 147.57,97.6 147.57,99.82 LED17.5 | 159,97.92 158.69,97.6 147.57,97.6 | 159,97.92 159.64,98.55 159.64,99.19 160.27,99.82 LED18.5 | 171.7,97.92 171.39,97.6 159.32,97.6 159,97.92 | 171.7,97.92 172.34,98.55 172.34,99.19 172.97,99.82 LED19.5 | LED20.5 185.67,99.82 185.04,99.19 185.04,98.55 184.09,97.6 172.02,97.6 171.7,97.92 | 59.31,98.55 59.31,99.19 58.67,99.82 LED11.5 | 59.31,98.55 60.26,97.6 71.06,97.6 | 71.06,97.6 71.06,99.82 LED12.5 | 82.17,97.92 81.85,97.6 71.06,97.6 | 82.17,97.92 82.8,98.55 82.8,99.19 83.44,99.82 LED13.5 | 94.55,97.92 94.23,97.6 82.49,97.6 82.17,97.92 | 94.55,97.92 95.19,98.55 95.19,99.19 95.82,99.82 LED14.5 | 107.25,97.92 106.93,97.6 94.87,97.6 94.55,97.92 | 107.25,97.92 107.89,98.55 107.89,99.19 108.52,99.82 LED15.5 | X13.1 25.91,107.76 26.23,107.44 26.23,106.49 35.12,97.6 58.99,97.6 58.99,98.23 59.31,98.55 | 135.83,98.55 135.51,98.23 133.92,98.23 133.29,97.6 107.57,97.6 107.25,97.92
R3A  (via drill 0.61)
  Top 0.914: LED26.7 134.43,78.3 v134.43,81.47 | v144.59,81.47 146.18,79.88 146.18,77.66 LED27.7 | LED28.7 159.83,78.3 159.83,81.79 163,84.96 171.58,84.96 171.58,79.88 | 171.58,79.88 171.58,77.66 LED29.7 | 171.58,79.88 182.37,79.88 183.64,78.61 183.64,78.3 184.28,77.66 LED30.7 | 68.71,83.06 61.09,83.06 56.96,78.93 56.96,78.3 LED21.7 55.69,77.34 55.69,75.12 v48.07,75.12 | 68.71,83.06 68.71,77.66 LED22.7 | 79.82,82.74 79.5,83.06 68.71,83.06 | 79.82,82.74 80.77,81.79 80.77,78.3 81.41,77.66 LED23.7 | 92.52,82.74 92.2,83.06 80.14,83.06 79.82,82.74 | 92.52,82.74 93.47,81.79 93.47,78.3 94.11,77.66 LED24.7 | 106.17,81.47 106.17,81.79 104.9,83.06 92.84,83.06 92.52,82.74 | 106.17,81.47 106.17,78.3 106.81,77.66 LED25.7 | v106.49,81.47 106.17,81.47
  Bottom 0.914: LED30.7 184.59,77.66 180.78,81.47 v144.59,81.47 v134.43,81.47 v106.49,81.47 | X14.8 47.69,75.12 v48.07,75.12
R3B
  Top 0.914: 136.97,76.07 136.97,76.71 136.34,77.34 LED26.6 | 136.97,76.07 137.92,75.12 148.72,75.12 | 148.72,75.12 148.72,77.34 LED27.6 | LED28.6 160.78,76.71 160.78,76.07 160.15,75.44 | 160.15,75.44 159.83,75.12 148.72,75.12 | LED29.6 173.48,76.71 173.48,76.07 172.85,75.44 | 172.85,75.44 172.53,75.12 160.47,75.12 160.15,75.44 | LED30.6 186.18,76.71 186.18,76.07 185.23,75.12 173.16,75.12 172.85,75.44 | 59.5,76.07 59.5,76.71 58.86,77.34 LED21.6 | 59.5,76.07 60.45,75.12 71.25,75.12 | 71.25,75.12 71.25,77.34 LED22.6 | LED23.6 83.31,76.71 83.31,76.07 82.68,75.44 | 82.68,75.44 82.36,75.12 71.25,75.12 | LED24.6 96.01,76.71 96.01,76.07 95.38,75.44 | 95.38,75.44 95.06,75.12 82.99,75.12 82.68,75.44 | LED25.6 108.71,76.71 108.71,76.07 108.08,75.44 | 108.08,75.44 107.76,75.12 95.69,75.12 95.38,75.44 | X14.7 41.66,71.63 41.66,72.26 42.93,73.53 59.18,73.53 59.18,75.75 59.5,76.07 | 136.97,76.07 136.65,75.75 135.06,75.75 134.43,75.12 108.39,75.12 108.08,75.44
R3C
  Top 0.914: 146.18,64.64 135.38,64.64 134.43,63.69 134.43,63.06 LED26.4 133.48,62.74 131.57,64.64 105.54,64.64 105.22,64.33 | 146.18,64.64 146.18,62.42 LED27.4 | 157.29,64.33 156.97,64.64 146.18,64.64 | 157.29,64.33 158.24,63.37 158.24,63.06 158.88,62.42 LED28.4 | 169.99,64.33 169.67,64.64 157.61,64.64 157.29,64.33 | 169.99,64.33 170.94,63.37 170.94,63.06 171.58,62.42 LED29.4 | LED30.4 184.28,62.42 183.64,63.06 183.64,63.37 182.37,64.64 170.31,64.64 169.99,64.33 | LED21.4 56.96,63.06 56.96,63.69 57.6,64.33 | 57.6,64.33 57.91,64.64 68.71,64.64 | 68.71,64.64 68.71,62.42 LED22.4 | 79.82,64.33 79.5,64.64 68.71,64.64 | 79.82,64.33 80.77,63.37 80.77,63.06 81.41,62.42 LED23.4 | 92.52,64.33 92.2,64.64 80.14,64.64 79.82,64.33 | 92.52,64.33 93.47,63.37 93.47,63.06 94.11,62.42 LED24.4 | 105.22,64.33 104.9,64.64 92.84,64.64 92.52,64.33 | 105.22,64.33 106.17,63.37 106.17,63.06 106.81,62.42 LED25.4 | X14.6 38.48,70.67 39.12,70.04 39.12,69.41 43.88,64.64 57.28,64.64 57.6,64.33
R3D
  Bottom 0.914: 128.72,64.64 128.72,62.42 LED26.2 | 128.72,64.64 139.19,64.64 139.51,64.33 | 139.51,64.33 141.41,62.42 LED27.2 | 153.8,64.64 153.8,62.42 LED28.2 | 153.8,64.64 139.83,64.64 139.51,64.33 | 166.5,64.64 166.5,62.42 LED29.2 | 153.8,64.64 166.5,64.64 | 166.5,64.64 179.2,64.64 179.2,62.42 LED30.2 | 51.24,64.64 51.24,62.42 LED21.2 | 51.24,64.64 61.72,64.64 62.04,64.33 | 62.04,64.33 63.95,62.42 LED22.2 | 76.33,64.64 76.33,62.42 LED23.2 | 76.33,64.64 62.36,64.64 62.04,64.33 | 89.03,64.64 89.03,62.42 LED24.2 | 76.33,64.64 89.03,64.64 | 101.73,64.64 101.73,62.42 LED25.2 | 89.03,64.64 101.73,64.64 | X14.5 35.94,70.67 35.94,64.96 50.93,64.96 51.24,64.64 | 101.73,64.64 128.72,64.64
R3E
  Bottom 0.914: 126.17,59.88 126.17,62.1 LED26.1 | 126.17,59.88 136.97,59.88 137.29,60.2 | 137.29,60.2 138.56,61.47 138.56,62.1 LED27.1 | 151.26,59.88 151.26,62.1 LED28.1 | 151.26,59.88 137.6,59.88 137.29,60.2 | 163.96,59.88 163.96,62.1 LED29.1 | 151.26,59.88 163.96,59.88 | 163.96,59.88 176.66,59.88 176.66,62.1 LED30.1 | 59.82,60.2 61.09,61.47 61.09,62.1 LED22.1 | 59.82,60.2 59.5,59.88 48.71,59.88 48.71,62.1 LED21.1 48.39,62.42 33.4,62.42 33.4,70.67 X14.4 | 73.79,59.88 73.79,62.1 LED23.1 | 73.79,59.88 60.14,59.88 59.82,60.2 | 86.49,59.88 86.49,62.1 LED24.1 | 73.79,59.88 86.49,59.88 | 99.19,59.88 99.19,62.1 LED25.1 | 86.49,59.88 99.19,59.88 | 99.19,59.88 126.17,59.88
R3F
  Top 0.914: X14.3 31.5,71.63 31.5,72.26 39.12,79.88 50.93,79.88 50.93,77.66 LED21.9
  Bottom 0.914: 128.72,79.88 128.72,77.66 LED26.9 | 128.72,79.88 139.19,79.88 139.51,79.57 | 139.51,79.57 141.41,77.66 LED27.9 | 153.8,79.88 153.8,77.66 LED28.9 | 153.8,79.88 139.83,79.88 139.51,79.57 | 166.5,79.88 166.5,77.66 LED29.9 | 153.8,79.88 166.5,79.88 | 166.5,79.88 179.2,79.88 179.2,77.66 LED30.9 | 62.04,79.57 63.95,77.66 LED22.9 | 62.04,79.57 61.72,79.88 51.24,79.88 51.24,77.66 LED21.9 | 76.33,79.88 76.33,77.66 LED23.9 | 76.33,79.88 62.36,79.88 62.04,79.57 | 89.03,79.88 89.03,77.66 LED24.9 | 76.33,79.88 89.03,79.88 | 101.73,79.88 101.73,77.66 LED25.9 | 89.03,79.88 101.73,79.88 | 101.73,79.88 128.72,79.88
R3G
  Bottom 0.914: 126.17,75.12 126.17,77.34 LED26.10 | 126.17,75.12 136.97,75.12 137.29,75.44 | 137.29,75.44 138.56,76.71 138.56,77.34 LED27.10 | 151.26,75.12 151.26,77.34 LED28.10 | 151.26,75.12 137.6,75.12 137.29,75.44 | 163.96,75.12 163.96,77.34 LED29.10 | 151.26,75.12 163.96,75.12 | 163.96,75.12 176.66,75.12 176.66,77.34 LED30.10 | 59.82,75.44 61.09,76.71 61.09,77.34 LED22.10 | 59.82,75.44 59.5,75.12 50.29,75.12 48.71,76.71 48.71,77.34 LED21.10 48.39,76.71 28.32,76.71 28.32,70.99 X14.2 | 73.79,75.12 73.79,77.34 LED23.10 | 73.79,75.12 60.14,75.12 59.82,75.44 | 86.49,75.12 86.49,77.34 LED24.10 | 73.79,75.12 86.49,75.12 | 99.19,75.12 99.19,77.34 LED25.10 | 86.49,75.12 99.19,75.12 | 99.19,75.12 126.17,75.12
R3H
  Top 0.914: 136.97,60.83 136.97,61.47 136.34,62.1 LED26.5 | 136.97,60.83 137.92,59.88 148.72,59.88 | 148.72,59.88 148.72,62.1 LED27.5 | LED28.5 160.78,61.47 160.78,60.83 160.15,60.2 | 160.15,60.2 159.83,59.88 148.72,59.88 | LED29.5 173.48,61.47 173.48,60.83 172.85,60.2 | 172.85,60.2 172.53,59.88 160.47,59.88 160.15,60.2 | LED30.5 186.18,61.47 186.18,60.83 185.23,59.88 173.16,59.88 172.85,60.2 | 59.5,60.83 59.5,61.47 58.86,62.1 LED21.5 | 59.5,60.83 60.45,59.88 71.25,59.88 | 71.25,59.88 71.25,62.1 LED22.5 | LED23.5 83.31,61.47 83.31,60.83 82.68,60.2 | 82.68,60.2 82.36,59.88 71.25,59.88 | LED24.5 96.01,61.47 96.01,60.83 95.38,60.2 | 95.38,60.2 95.06,59.88 82.99,59.88 82.68,60.2 | LED25.5 108.71,61.47 108.71,60.83 108.08,60.2 | 108.08,60.2 107.76,59.88 95.69,59.88 95.38,60.2 | X14.1 25.78,70.67 26.42,70.04 26.42,69.41 35.94,59.88 59.18,59.88 59.18,60.52 59.5,60.83 | 136.97,60.83 136.65,60.52 135.06,60.52 134.43,59.88 108.39,59.88 108.08,60.2
R4A  (via drill 0.61)
  Top 0.914: LED39.7 171.96,43.88 | 171.96,43.88 171.96,45.47 164.34,45.47 160.21,41.34 160.21,41.02 159.26,40.07 LED38.7 | v147.51,35.94 147.51,38.8 146.56,39.75 LED37.7 | 171.96,43.88 188.79,43.88 188.79,38.48 187.83,37.53 184.66,37.53 LED40.7 | 69.09,45.47 61.47,45.47 57.34,41.34 57.34,41.02 56.39,40.07 LED31.7 56.39,39.43 v52.9,35.94 | LED32.7 69.09,45.47 | 80.2,45.15 79.88,45.47 69.09,45.47 | 80.2,45.15 80.84,44.51 80.84,41.02 81.79,40.07 LED33.7 | 92.9,45.15 92.58,45.47 80.52,45.47 80.2,45.15 | 92.9,45.15 93.54,44.51 93.54,41.02 94.49,40.07 LED34.7 | 105.6,45.15 105.28,45.47 93.22,45.47 92.9,45.15 | 105.6,45.15 106.24,44.51 106.24,41.02 107.19,40.07 LED35.7 | 105.6,45.15 105.92,45.47 131.95,45.47 132.91,44.51 132.91,41.02 133.86,40.07 LED36.7 v133.86,35.94
  Bottom 0.914: LED40.7 184.66,39.43 181.17,35.94 v147.51,35.94 v133.86,35.94 | v52.9,35.94 52.58,35.62 49.21,35.62 43.82,30.23 X15.8
R4B
  Top 0.914: 137.99,37.85 141.48,34.35 149.1,34.35 149.1,37.53 | 137.99,37.85 137.35,38.48 137.35,38.8 136.4,39.75 LED36.6 | LED37.6 149.1,37.53 | 160.21,37.85 159.89,37.53 149.1,37.53 | 160.21,37.85 160.85,38.48 160.85,38.8 161.8,39.75 LED38.6 | 160.21,37.85 160.53,37.53 172.59,37.53 173.55,38.48 173.55,38.8 174.5,39.75 LED39.6 174.82,40.07 174.82,42.29 185.29,42.29 186.25,41.34 186.25,41.02 187.2,40.07 LED40.6 | 59.88,38.48 59.88,38.8 58.93,39.75 LED31.6 | 59.88,38.48 60.83,37.53 71.63,37.53 | LED32.6 71.63,37.53 | 82.74,37.85 82.42,37.53 71.63,37.53 | 82.74,37.85 83.38,38.48 83.38,38.8 84.33,39.75 LED33.6 | 95.44,37.85 95.12,37.53 83.06,37.53 82.74,37.85 | 95.44,37.85 96.07,38.48 96.07,38.8 97.03,39.75 LED34.6 | 95.44,37.85 95.76,37.53 107.82,37.53 108.77,38.48 108.77,38.8 109.73,39.75 LED35.6 110.05,39.43 121.48,39.43 126.55,34.35 134.49,34.35 137.99,37.85 | X15.7 41.28,30.23 41.91,30.86 41.91,31.81 44.45,34.35 59.56,34.35 59.56,38.16 59.88,38.48
R4C
  Top 0.914: 146.56,27.05 135.76,27.05 134.81,26.1 134.81,25.78 133.86,24.83 LED36.4 133.86,25.46 132.27,27.05 105.92,27.05 105.6,26.73 | LED37.4 146.56,27.05 | 157.67,26.73 157.35,27.05 146.56,27.05 | 157.67,26.73 158.31,26.1 158.31,25.78 159.26,24.83 LED38.4 | 170.37,26.73 170.05,27.05 157.99,27.05 157.67,26.73 | 170.37,26.73 171.01,26.1 171.01,25.78 171.96,24.83 LED39.4 | LED40.4 184.66,24.83 183.71,25.78 183.71,26.1 182.75,27.05 170.69,27.05 170.37,26.73 | 57.98,26.73 58.29,27.05 69.09,27.05 | 57.98,26.73 57.34,26.1 57.34,25.78 56.39,24.83 LED31.4 | LED32.4 69.09,27.05 | 80.2,26.73 79.88,27.05 69.09,27.05 | 80.2,26.73 80.84,26.1 80.84,25.78 81.79,24.83 LED33.4 | 92.9,26.73 92.58,27.05 80.52,27.05 80.2,26.73 | 92.9,26.73 93.54,26.1 93.54,25.78 94.49,24.83 LED34.4 | 105.6,26.73 105.28,27.05 93.22,27.05 92.9,26.73 | 105.6,26.73 106.24,26.1 106.24,25.78 107.19,24.83 LED35.4 | X15.6 38.73,30.23 39.37,29.59 39.37,28.64 40.96,27.05 57.66,27.05 57.98,26.73
R4D
  Bottom 0.914: 128.78,27.05 LED36.2 | 128.78,27.05 139.57,27.05 139.89,26.73 | 139.89,26.73 141.48,25.15 LED37.2 | 154.18,27.05 LED38.2 | 154.18,27.05 140.21,27.05 139.89,26.73 | 166.88,27.05 LED39.2 | 154.18,27.05 166.88,27.05 | LED40.2 179.58,27.05 166.88,27.05 | 51.31,27.05 LED31.2 | 51.31,27.05 62.1,27.05 62.42,26.73 | 62.42,26.73 64.01,25.15 LED32.2 | 76.71,27.05 LED33.2 | 76.71,27.05 62.74,27.05 62.42,26.73 | 89.41,27.05 LED34.2 | 76.71,27.05 89.41,27.05 | 102.11,27.05 LED35.2 | 89.41,27.05 102.11,27.05 | X15.5 36.2,30.23 36.2,27.37 50.99,27.37 51.31,27.05 | 102.11,27.05 128.78,27.05
R4E
  Bottom 0.914: 126.24,22.29 LED36.1 | 126.24,22.29 137.03,22.29 137.35,22.61 | 137.35,22.61 138.94,24.19 LED37.1 | 151.64,22.29 LED38.1 | 151.64,22.29 137.67,22.29 137.35,22.61 | 164.34,22.29 LED39.1 | 151.64,22.29 164.34,22.29 | LED40.1 177.04,22.29 164.34,22.29 | 59.88,22.61 61.47,24.19 LED32.1 | 59.88,22.61 59.56,22.29 48.77,22.29 LED31.1 48.45,24.83 33.66,24.83 33.66,30.23 X15.4 | 74.17,22.29 LED33.1 | 74.17,22.29 60.2,22.29 59.88,22.61 | 86.87,22.29 LED34.1 | 74.17,22.29 86.87,22.29 | 99.57,22.29 LED35.1 | 86.87,22.29 99.57,22.29 | 99.57,22.29 126.24,22.29
R4F
  Top 0.914: LED31.9 51.31,37.53 37.47,37.53 31.75,31.81 31.75,30.86 31.11,30.23 X15.3
  Bottom 0.914: 128.78,42.29 LED36.9 | 128.78,42.29 139.57,42.29 139.89,41.97 | 139.89,41.97 141.48,40.39 LED37.9 | 154.18,42.29 LED38.9 | 154.18,42.29 140.21,42.29 139.89,41.97 | 166.88,42.29 LED39.9 | 154.18,42.29 166.88,42.29 | LED40.9 179.58,42.29 166.88,42.29 | LED31.9 51.31,42.29 62.1,42.29 62.42,41.97 | 62.42,41.97 64.01,40.39 LED32.9 | 76.71,42.29 LED33.9 | 76.71,42.29 62.74,42.29 62.42,41.97 | 89.41,42.29 LED34.9 | 76.71,42.29 89.41,42.29 | 102.11,42.29 LED35.9 | 89.41,42.29 102.11,42.29 | 102.11,42.29 128.78,42.29
R4G
  Bottom 0.914: 126.24,37.53 LED36.10 | 126.24,37.53 137.03,37.53 137.35,37.85 | 137.35,37.85 138.94,39.43 LED37.10 | 151.64,37.53 LED38.10 | 151.64,37.53 137.67,37.53 137.35,37.85 | 164.34,37.53 LED39.10 | 151.64,37.53 164.34,37.53 | LED40.10 177.04,37.53 164.34,37.53 | 48.77,37.53 LED31.10 | 48.77,37.53 59.56,37.53 59.88,37.85 | 59.88,37.85 61.47,39.43 LED32.10 | 74.17,37.53 LED33.10 | 74.17,37.53 60.2,37.53 59.88,37.85 | 86.87,37.53 LED34.10 | 74.17,37.53 86.87,37.53 | 99.57,37.53 LED35.10 | 86.87,37.53 99.57,37.53 | X15.2 28.57,30.23 28.57,37.21 48.45,37.21 48.77,37.53 | 99.57,37.53 126.24,37.53
R4H
  Top 0.914: 149.1,22.29 138.3,22.29 137.35,23.24 137.35,23.56 136.4,24.51 LED36.5 136.4,23.88 134.81,22.29 108.46,22.29 108.14,22.61 | LED37.5 149.1,22.29 | 160.21,22.61 159.89,22.29 149.1,22.29 | 160.21,22.61 160.85,23.24 160.85,23.56 161.8,24.51 LED38.5 | 172.91,22.61 172.59,22.29 160.53,22.29 160.21,22.61 | 172.91,22.61 173.55,23.24 173.55,23.56 174.5,24.51 LED39.5 | LED40.5 187.2,24.51 186.25,23.56 186.25,23.24 185.29,22.29 173.23,22.29 172.91,22.61 | 59.88,23.24 59.88,23.56 58.93,24.51 LED31.5 | 59.88,23.24 60.83,22.29 71.63,22.29 | LED32.5 71.63,22.29 | 82.74,22.61 82.42,22.29 71.63,22.29 | 82.74,22.61 83.38,23.24 83.38,23.56 84.33,24.51 LED33.5 | 95.44,22.61 95.12,22.29 83.06,22.29 82.74,22.61 | 95.44,22.61 96.07,23.24 96.07,23.56 97.03,24.51 LED34.5 | 108.14,22.61 107.82,22.29 95.76,22.29 95.44,22.61 | 108.14,22.61 108.77,23.24 108.77,23.56 109.73,24.51 LED35.5 | X15.1 26.04,30.23 26.67,29.59 26.67,28.64 33.02,22.29 59.56,22.29 59.56,22.92 59.88,23.24
SEG1  (via drill 0.61)
  Top 0.914: v54.04,156.02 54.04,153.16 53.09,152.21 LED1.8
  Bottom 0.914: v54.04,156.02 65.15,167.13 125.48,167.13 X2.10
SEG2  (via drill 0.61)
  Top 0.914: v66.74,156.02 66.74,153.16 65.79,152.21 LED2.8
  Bottom 0.914: v66.74,156.02 76.26,165.54 123.89,165.54 124.52,164.91 126.43,164.91 128.02,166.5 X2.9
SEG3  (via drill 0.61)
  Top 0.914: v78.49,156.02 LED3.8 | v123.25,163.96 130.56,163.96 X2.8
  Bottom 0.914: v78.49,156.02 86.42,163.96 v123.25,163.96
SEG4  (via drill 0.61)
  Top 0.914: v91.19,156.02 LED4.8
  Bottom 0.914: v91.19,156.02 94.36,159.19 104.84,159.19 106.43,160.78 116.9,160.78 118.49,162.37 128.97,162.37 133.1,166.5 X2.7
SEG5  (via drill 0.61)
  Top 0.914: v103.89,156.02 LED5.8
  Bottom 0.914: v103.89,156.02 107.06,159.19 117.54,159.19 119.13,160.78 129.92,160.78 135.64,166.5 X2.6
SEG6  (via drill 0.61)
  Top 0.914: v116.59,156.02 LED6.8
  Bottom 0.914: v116.59,156.02 119.76,159.19 130.87,159.19 138.18,166.5 X2.5
SEG7  (via drill 0.61)
  Top 0.914: v129.29,156.02 LED7.8
  Bottom 0.914: v129.29,156.02 130.87,157.61 133.1,157.61 140.72,165.23 X2.4
SEG8
  Top 0.914: LED8.8 141.99,152.21 142.94,153.16 142.94,166.81 143.26,167.13 X2.3
SEG9  (via drill 0.61)
  Top 0.914: v154.69,157.29 LED9.8
  Bottom 0.914: v154.69,157.29 145.8,166.18 X2.2
SEG10
  Bottom 0.914: LED10.8 167.39,167.13 148.34,167.13 X2.1
SEG11
  Top 0.914: LED11.8 53.59,115.06 54.23,115.7 54.23,116.33 67.56,129.67 124.71,129.67 X3.10
SEG12  (via drill 0.61)
  Top 0.914: v66.93,118.87 66.93,115.7 66.29,115.06 LED12.8
  Bottom 0.914: v66.93,118.87 75.18,127.13 125.35,127.13 127.25,129.03 X3.9
SEG13  (via drill 0.61)
  Top 0.914: v78.36,118.87 78.36,115.06 LED13.8
  Bottom 0.914: v78.36,118.87 85.03,125.54 126.3,125.54 129.79,129.03 X3.8
SEG14  (via drill 0.61)
  Top 0.914: v91.06,118.87 91.06,115.06 LED14.8
  Bottom 0.914: v91.06,118.87 92.65,120.46 103.12,120.46 104.71,122.05 125.35,122.05 132.33,129.03 X3.7
SEG15  (via drill 0.61)
  Top 0.914: v103.76,118.87 103.76,115.06 LED15.8
  Bottom 0.914: v103.76,118.87 105.35,120.46 128.84,120.46 134.87,126.49 X3.6
SEG16
  Top 0.914: X3.5 137.41,129.03 130.75,122.36 130.75,115.7 130.11,115.06 LED16.8
SEG17
  Top 0.914: X3.4 139.95,129.03 141.86,127.13 141.86,115.7 142.49,115.06 LED17.8
SEG18
  Top 0.914: X3.3 142.49,129.03 154.56,116.97 154.56,115.7 155.19,115.06 LED18.8
SEG19  (via drill 0.61)
  Top 0.914: v167.26,120.46 167.26,115.7 167.89,115.06 LED19.8
  Bottom 0.914: v167.26,120.46 160.59,127.13 146.94,127.13 145.03,129.03 X3.2
SEG20
  Bottom 0.914: LED20.8 180.91,115.06 180.91,112.84 186.63,112.84 187.58,113.79 187.58,129.67 147.57,129.67 X3.1
SEG21
  Top 0.914: LED21.8 54.42,78.3 54.42,78.93 66.17,90.68 125.54,90.68 X4.10
SEG22  (via drill 0.61)
  Top 0.914: LED22.8 67.12,78.3 v67.12,81.47
  Bottom 0.914: v67.12,81.47 74.1,88.46 126.49,88.46 128.08,90.04 128.08,90.68 X4.9
SEG23  (via drill 0.61)
  Top 0.914: v78.87,81.47 78.87,77.66 LED23.8
  Bottom 0.914: v78.87,81.47 84.27,86.87 127.44,86.87 130.62,90.04 130.62,90.68 X4.8
SEG24  (via drill 0.61)
  Top 0.914: v91.57,81.47 91.57,77.66 LED24.8
  Bottom 0.914: v91.57,81.47 93.16,83.06 103.63,83.06 105.22,84.64 127.76,84.64 133.16,90.04 133.16,90.68 X4.7
SEG25  (via drill 0.61)
  Top 0.914: v104.27,81.47 104.27,77.66 LED25.8
  Bottom 0.914: v104.27,81.47 105.85,83.06 129.03,83.06 135.7,89.72 135.7,90.68 X4.6
SEG26
  Top 0.914: LED26.8 131.89,78.3 131.89,83.69 138.24,90.04 138.24,90.68 X4.5
SEG27
  Top 0.914: LED27.8 143.64,77.66 143,78.3 143,86.87 141.1,88.77 141.1,90.68 X4.4
SEG28
  Top 0.914: LED28.8 156.34,77.66 155.7,78.3 155.7,78.61 145.86,88.46 143.64,88.46 143.64,90.68 X4.3
SEG29  (via drill 0.61)
  Top 0.914: v168.4,83.06 168.4,78.3 169.04,77.66 LED29.8
  Bottom 0.914: v168.4,83.06 163,88.46 147.76,88.46 146.18,90.04 146.18,90.68 X4.2
SEG30
  Bottom 0.914: LED30.8 182.06,77.34 182.06,75.12 187.77,75.12 188.72,76.07 188.72,90.68 148.72,90.68 X4.1
SEG31
  Top 0.914: LED31.8 53.85,40.07 54.8,41.02 54.8,41.34 64.96,51.5 124.65,51.5 X5.10
SEG32  (via drill 0.61)
  Top 0.914: v67.5,43.88 67.5,41.02 66.55,40.07 LED32.8
  Bottom 0.914: v67.5,43.88 77.66,54.04 125.6,54.04 127.19,52.45 127.19,51.82 X5.9
SEG33  (via drill 0.61)
  Top 0.914: v79.25,43.88 LED33.8
  Bottom 0.914: v79.25,43.88 84.33,48.96 127.82,48.96 129.73,50.86 129.73,51.5 X5.8
SEG34  (via drill 0.61)
  Top 0.914: v91.95,43.88 LED34.8
  Bottom 0.914: v91.95,43.88 95.44,47.37 128.78,47.37 132.27,50.86 132.27,51.5 X5.7
SEG35  (via drill 0.61)
  Top 0.914: v104.65,43.88 LED35.8
  Bottom 0.914: v104.65,43.88 106.24,45.47 129.41,45.47 134.81,50.86 134.81,51.5 X5.6
SEG36  (via drill 0.61)
  Top 0.914: v131.32,43.88 LED36.8
  Bottom 0.914: v131.32,43.88 137.35,49.91 137.35,51.5 X5.5
SEG37
  Top 0.914: LED37.8 144.02,40.07 143.07,41.02 143.07,46.42 140.21,49.28 140.21,51.5 X5.4
SEG38
  Top 0.914: LED38.8 156.72,40.07 155.77,41.02 155.77,41.34 148.15,48.96 142.75,48.96 142.75,51.5 X5.3
SEG39  (via drill 0.61)
  Top 0.914: v168.47,43.88 168.47,41.02 169.42,40.07 LED39.8
  Bottom 0.914: v168.47,43.88 163.39,48.96 146.88,48.96 145.29,50.55 145.29,51.5 X5.2
SEG40
  Bottom 0.914: LED40.8 182.12,51.5 147.83,51.5 X5.1
SH_CP  (via drill 0.61)
  Top 0.914: 166.69,230.82 174.62,238.76 183.52,238.76 183.52,229.24 IC1.11 | 166.69,230.82 165.74,229.87 165.74,226.06 158.12,226.06 156.21,227.97 156.21,228.6 IC3.11 | v99.06,233.04 99.06,229.87 99.69,229.24 IC4.11 | IC2.11 127.63,229.24 127,229.87 v127,233.04 130.18,236.22 130.18,236.85 160.66,236.85 166.69,230.82
  Bottom 0.914: 73.98,232.73 71.75,230.5 IC5.11 | 73.98,232.73 74.3,233.04 v99.06,233.04 v127,233.04 | X11.2 72.39,240.03 72.39,233.04 73.66,233.04 73.98,232.73
ST_CP
  Top 0.914: IC5.12 69.85,229.87 69.85,229.24 71.75,227.33 83.19,227.33 83.19,227.97 86.36,231.14 97.16,231.14 97.16,229.24 IC4.12
  Bottom 0.914: IC5.12 69.85,230.5 69.85,240.03 X11.1 | 124.14,230.82 125.73,229.24 IC2.12 | 124.14,230.82 123.82,231.14 97.79,231.14 97.79,229.24 IC4.12 | 153.03,231.14 153.03,229.24 IC3.12 | 153.03,231.14 124.46,231.14 124.14,230.82 | 153.03,231.14 180.98,231.14 180.98,229.24 IC1.12
VCC
  Top 0.914: 163.83,210.82 165.74,208.91 IC6.10 | 163.83,210.82 163.83,221.62 170.81,228.6 IC1.16 | 135.89,210.82 136.21,210.5 | 136.21,210.5 137.8,208.91 IC8.10 | 135.89,210.82 135.89,221.62 142.88,228.6 IC3.16 | 107.95,210.82 108.27,210.5 | 108.27,210.5 109.85,208.91 IC7.10 | 107.95,210.82 107.95,221.62 114.94,228.6 IC2.16 | 80.01,210.82 80.33,210.5 | 80.33,210.5 81.91,208.91 IC9.10 79.76,210.82 | 80.01,210.82 80.01,221.62 86.99,228.6 IC4.16 | 52.39,210.5 52.07,210.82 52.07,222.88 59.05,229.87 IC5.16 | 52.39,210.5 53.98,208.91 IC10.10 | 52.71,210.82 79.76,210.82 | 79.76,210.82 80.01,210.82 | 52.71,210.82 52.39,210.5 | 107.95,210.82 80.64,210.82 80.33,210.5 | 135.89,210.82 108.58,210.82 108.27,210.5 | 163.83,210.82 136.53,210.82 136.21,210.5 | 52.71,210.82 52.32,210.82 | 38.16,206.06 39.12,207.01 T2.3 | 38.16,206.06 37.85,205.74 37.85,202.56 39.12,201.29 T1.3 | 38.16,211.77 37.85,211.46 37.85,206.38 38.16,206.06 | 38.16,211.77 39.12,212.72 T3.3 | 38.16,217.49 37.85,217.17 37.85,212.09 38.16,211.77 | 38.16,217.49 39.12,218.44 T4.3 | 38.16,223.2 37.85,222.88 37.85,217.81 38.16,217.49 | 38.16,223.2 39.12,224.16 T5.3 | 38.16,228.92 37.85,228.6 37.85,223.52 38.16,223.2 | 38.16,228.92 39.12,229.87 T6.3 | 38.16,234.63 37.85,234.31 37.85,229.24 38.16,228.92 | 38.16,234.63 39.12,235.59 T7.3 | T8.3 39.12,241.3 37.85,240.03 37.85,234.95 38.16,234.63
  Bottom 0.914: T2.3 39.75,207.01 41.02,208.28 53.72,208.28 IC10.10